# Altium schematic sheet Sheet1 (Luggi-PCs in Konflikt stehende Kopie 2014-04-20).SchDoc
size A4
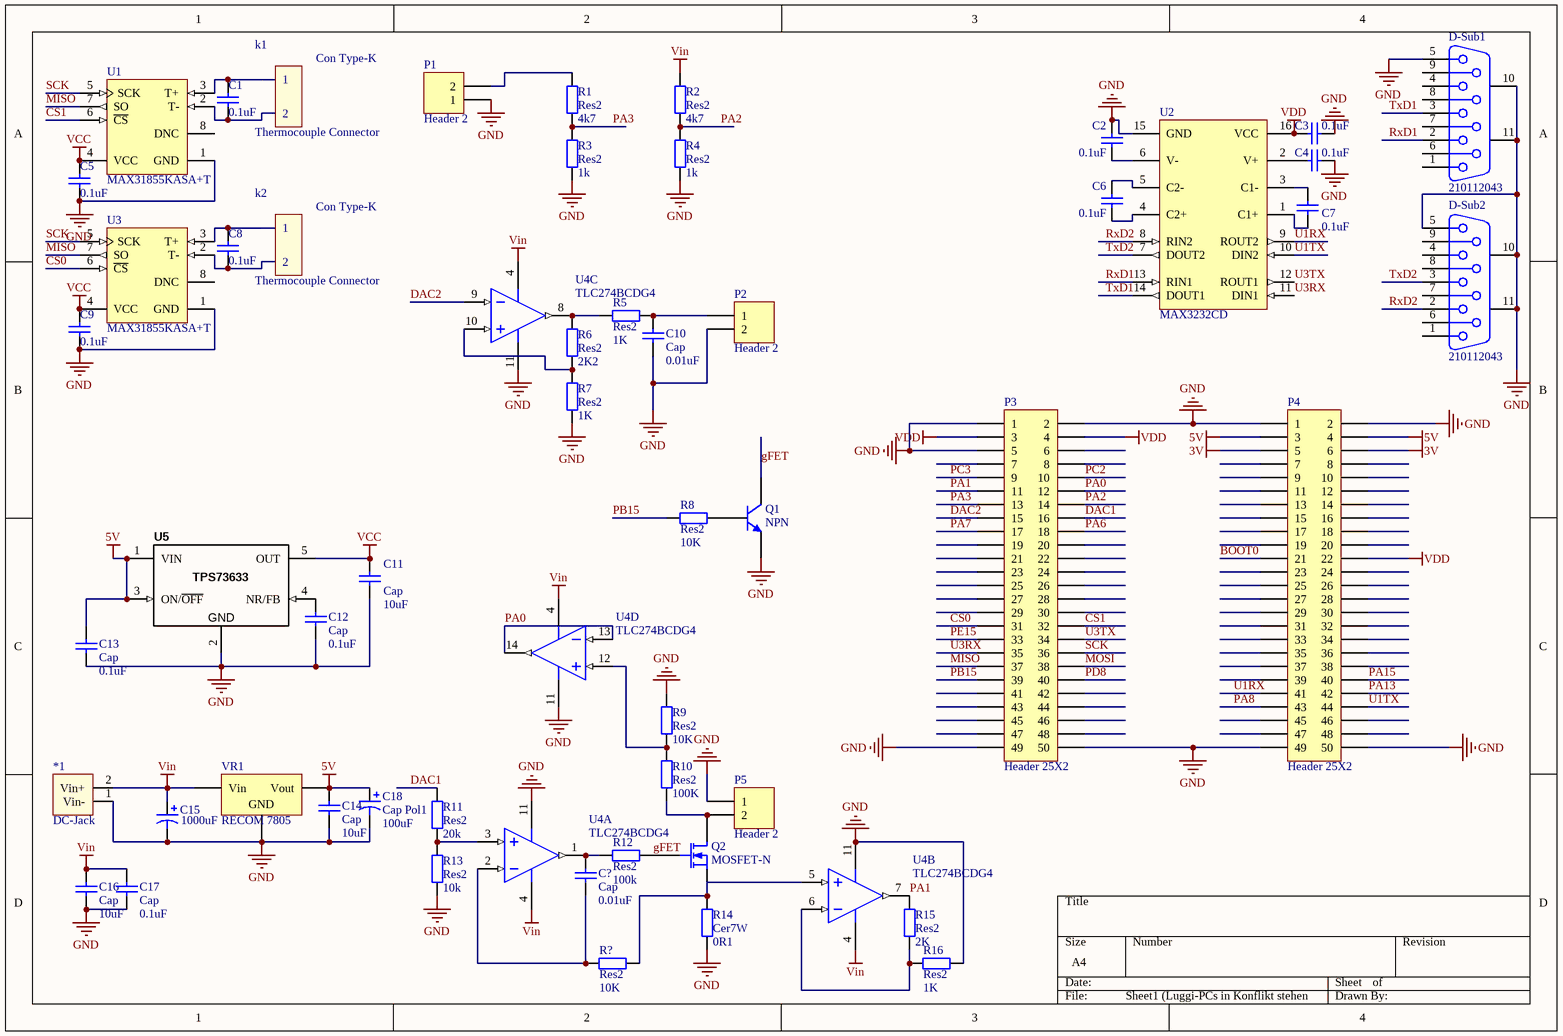
[diagram p0: Sheet1 (Luggi-PCs in Konflikt stehende Kopie 2014-04-20).SchDoc]

## Parts
*1  DC-Jack  [DC-Jack]
C1  value 0.1uF  [CAPC2012X135N]  (hidden comment: Cap)
C2  value 0.1uF  [CAPC2012X135N]  (hidden comment: Cap)
C3  value 0.1uF  [CAPC2012X135N]  (hidden comment: Cap)
C4  value 0.1uF  [CAPC2012X135N]  (hidden comment: Cap)
C5  value 0.1uF  [CAPC2012X135N]  (hidden comment: Cap)
C6  value 0.1uF  [CAPC2012X135N]  (hidden comment: Cap)
C7  value 0.1uF  [CAPC2012X135N]  (hidden comment: Cap)
C8  value 0.1uF  [CAPC2012X135N]  (hidden comment: Cap)
C9  value 0.1uF  [CAPC2012X135N]  (hidden comment: Cap)
C10  Cap  value 0.01uF  [CAPC2012X135N]
C11  Cap  value 10uF  [CAPC2012X135N]
C12  Cap  value 0.1uF  [CAPC2012X135N]
C13  Cap  value 0.1uF  [CAPC2012X135N]
C14  Cap  value 10uF  [CAPC2012X135N]
C15  value 1000uF  [RB7.6-15]  (hidden comment: Cap Pol1)
C16  Cap  value 10uF  [CAPC2012X135N]
C17  Cap  value 0.1uF  [CAPC2012X135N]
C18  Cap Pol1  value 100uF  [RB7.6-15]
C?  Cap  value 0.01uF  [RAD-0.3]
D-Sub1  210112043  [WE-DS, 210112043]
D-Sub2  210112043  [WE-DS, 210112043]
k1  Thermocouple Connector  [K-Type Thermocouple Connector]
k2  Thermocouple Connector  [K-Type Thermocouple Connector]
P1  Header 2  [HDR1X2]
P2  Header 2  [HDR1X2]
P3  Header 25X2  [HDR2X25]
P4  Header 25X2  [HDR2X25]
P5  Header 2  [Connector6A]
Q1  NPN  [SOT-23_N]
Q2  MOSFET-N  [TO-220-AB]
R1  Res2  value 4k7  [RESC2012X70N]
R2  Res2  value 4k7  [RESC2012X70N]
R3  Res2  value 1k  [RESC2012X70N]
R4  Res2  value 1k  [RESC2012X70N]
R5  Res2  value 1K  [RESC2012X70N]
R6  Res2  value 2K2  [RESC2012X70N]
R7  Res2  value 1K  [RESC2012X70N]
R8  Res2  value 10K  [RESC2012X70N]
R9  Res2  value 10K  [RESC2012X70N]
R10  Res2  value 100K  [RESC2012X70N]
R11  Res2  value 20k  [RESC2012X70N]
R12  Res2  value 100k  [RESC2012X70N]
R13  Res2  value 10k  [RESC2012X70N]
R14  Cer7W  value 0R1  [Cer7W]
R15  Res2  value 2K  [RESC2012X70N]
R16  Res2  value 1K  [RESC2012X70N]
R?  Res2  value 10K  [AXIAL-0.4]
U1  MAX31855KASA+T  [MAXM-S8+4_N]
U2  MAX3232CD  [TI-D16_N]
U3  MAX31855KASA+T  [MAXM-S8+4_N]
U4  TLC274BCDG4  [TI-D14_N]  (parts A,B,C,D of 4)
U5  3.3V  [SOT23-5]  (value not drawn)
VR1  RECOM 7805  [Recom78xx]

## Nets
3V: P4.5 P4.6
5V: C13.2 C14.2 C18.1 P4.3 P4.4 U5.1(VIN) U5.3(ON/~{OFF}) VR1.3(Vout)
GND: *1.1(Vin-) C2.2 C3.1 C4.1 C5.1 C9.1 C10.1 C11.1 C12.1 C13.1 C14.1 C15.2 C16.1 C17.1 C18.2 D-Sub1.5 D-Sub1.10(MH1) D-Sub1.11(MH2) D-Sub2.5 D-Sub2.10(MH1) D-Sub2.11(MH2) P1.1 P2.2 P3.1 P3.2 P3.5 P3.49 P3.50 P4.1 P4.2 P4.49 P4.50 P5.1 Q1.3(E) R3.1 R4.1 R7.1 R9.2 R13.1 R14.1 R16.1 U1.1(GND) U2.15(GND) U3.1(GND) U4.11(GND) U5.2(GND) VR1.2(GND)
VCC: C5.2 C9.2 C11.2 U1.4(VCC) U3.4(VCC) U5.5(OUT)
VDD: C3.2 P3.3 P3.4 P4.22 U2.16(VCC)
Vin: *1.2(Vin+) C15.1 C16.2 C17.2 R2.2 U4.4(VDD) VR1.1(Vin)
BOOT0: P4.21
CS0: P3.31 U3.6(~{CS})
CS1: P3.32 U1.6(~{CS})
DAC1: P3.16 R11.2
DAC2: P3.15 U4.9(IN3-)
gFET: Q1.1(C) Q2.2(G) R12.2
MISO: P3.37 U1.7(SO) U3.7(SO)
MOSI: P3.38
PA0: P3.12 U4.13(IN4-) U4.14(OUT4)
PA1: P3.11 R15.2 U4.7(OUT2)
PA2: P3.14 R2.1 R4.2
PA3: P3.13 R1.1 R3.2
PA6: P3.18
PA7: P3.17
PA8: P4.43
PA13: P4.42
PA15: P4.40
PB15: P3.39 R8.2
PC2: P3.10
PC3: P3.9
PD8: P3.40
PE15: P3.33
RxD1: D-Sub1.2 U2.13(RIN1)
RxD2: D-Sub2.2 U2.8(RIN2)
SCK: P3.36 U1.5(SCK) U3.5(SCK)
TxD1: D-Sub1.3 U2.14(DOUT1)
TxD2: D-Sub2.3 U2.7(DOUT2)
U1RX: P4.41 U2.9(ROUT2)
U1TX: P4.44 U2.10(DIN2)
U3RX: P3.35 U2.11(DIN1)
U3TX: P3.34 U2.12(ROUT1)
NetC1_1: C1.1 k1.2 U1.2(T-)
NetC1_2: C1.2 k1.1 U1.3(T+)
NetC2_1: C2.1 U2.6(V-)
NetC4_2: C4.2 U2.2(V+)
NetC6_1: C6.1 U2.4(C2+)
NetC6_2: C6.2 U2.5(C2-)
NetC7_1: C7.1 U2.1(C1+)
NetC7_2: C7.2 U2.3(C1-)
NetC8_1: C8.1 k2.2 U3.2(T-)
NetC8_2: C8.2 k2.1 U3.3(T+)
NetC10_2: C10.2 P2.1 R5.2
NetC12_2: C12.2 U5.4(NR/FB)
NetC?_1: C?.1 R?.1 U4.2(IN1-)
NetC?_2: C?.2 R12.1 U4.1(OUT1)
NetP1_2: P1.2 R1.2
NetP5_2: P5.2 Q2.1(D) R10.1
NetQ1_2: Q1.2(B) R8.1
NetQ2_3: Q2.3(S) R14.2 R?.2 U4.5(IN2+)
NetR5_1: R5.1 R6.2 U4.8(OUT3)
NetR6_1: R6.1 R7.2 U4.10(IN3+)
NetR9_1: R9.1 R10.2 U4.12(IN4+)
NetR11_1: R11.1 R13.2 U4.3(IN1+)
NetR15_1: R15.1 R16.2 U4.6(IN2-)

Not connected (* = marked no-connect by the designer): D-Sub1 1 4 6 7 8 9; D-Sub2 1 4 6 7 8 9; P3 6 7 8 19 20 21 22 23 24 25 26 27 28 29 30 41 42 43 44 45 46 47 48; P4 7 8 9 10 11 12 13 14 15 16 17 18 19 20 23 24 25 26 27 28 29 30 31 32 33 34 35 36 37 38 39 45 46 47 48; U1 8(DNC); U3 8(DNC)

## Notes on the sheet
- (in symbol LinREG_3V3_400mA_TPS73633DBV) TPS73633
- (in symbol Thermocouple Connector) Con Type-K

## Library data of the parts
C1-C14 C16 C17 C? = Cap: Capacitor; Published: 8-Jun-2000; LatestRevisionDate: 17-Jul-2002; LatestRevisionNote: Re-released for DXP Platform.; PackageReference: RAD-0.3; Publisher: Altium Limited; PackageDescription: Radial Cap, Thru-Hole; 2 Leads; 0.3 in Pin Spacing
C15 C18 = Cap Pol1: Polarized Capacitor (Radial); Published: 8-Jun-2000; LatestRevisionDate: 17-Jul-2002; LatestRevisionNote: Re-released for DXP Platform.; PackageReference: RB7.6-15; Publisher: Altium Limited; PackageDescription: Polarized Capacitor (Radial); 2 Leads
D-Sub1 D-Sub2 = WE-DS, 210112043: D-SUB-Filter Connectors WE-DS, Bent 90°,TH; Manufacturer: Würth Elektronik eiSos GmbH; partNo: 210112043; ComponentLink1Description: Manufacturer; ComponentLink1URL: http://www.we-online.de; Created by: Christin Zierenner; Created Date: May 2012; ComponentLink2Description: Datasheet; ComponentLink2URL: http://katalog.we-online.de/kataloge/eisos/index.php?language=en&pf=Filter_abgewinkelt
P1 P2 P5 = Header 2: Header, 2-Pin; LatestRevisionDate: 17-Jul-2002; LatestRevisionNote: Re-released for DXP Platform.; Publisher: Altium Limited
P3 P4 = Header 25X2: Header, 25-Pin, Dual row; LatestRevisionDate: 17-Jul-2002; LatestRevisionNote: Re-released for DXP Platform.; Publisher: Altium Limited
Q1 = NPN: NPN Bipolar Transistor; pin to pad: 1>3 2>1 3>2; Published: 8-Jun-2000; LatestRevisionDate: 17-Jul-2002; LatestRevisionNote: Re-released for DXP Platform.; PackageReference: TO-226-AA; Publisher: Altium Limited; PackageDescription: TO, Flat Index; 3 In-Line, Axial Leads; Body Dia. 4.8mm; Leads 0.55 x 0.51 mm (max); Code_JEDEC: TO-226-AA
Q2 = MOSFET-N: N-Channel MOSFET; pin to pad: 1>2 2>1; Published: 8-Jun-2000; LatestRevisionDate: 17-Jul-2002; LatestRevisionNote: Re-released for DXP Platform.; PackageVersion: 1995/1996; PackageReference: E3; Publisher: Altium Limited; PackageDescription: TO, Flat Index; 3 In-Line, Axial Leads; Body Dia. 4.6mm; Lead Dia. 0.5 mm (max)
R1-R16 R? = Res2: Resistor; Published: 8-Jun-2000; LatestRevisionDate: 17-Jul-2002; LatestRevisionNote: Re-released for DXP Platform.; PackageReference: AXIAL-0.4; Publisher: Altium Limited; PackageDescription: Axial Device, Thru-Hole; 2 Leads; 0.4 in Pin Spacing
U1 U3 = MAX31855KASA+T: Cold Junction Compensated Thermocouple to Digital Converter, 14 Bits Temperature Resolution, -40 to 125 degC, 8-Pin SOIC (S8+4), Pb-Free, Tape ang Reel; Functions: Thermocouple-to-Digital Converter; Interface: SPI; Parasite Pwr.: No; DatasheetVersion: Rev. 2; PackageVersion: Rev. D, 10/2012; PackageReference: S8+4; PackageDescription: 8-Pin Small-Outline IC, Narrow, Body 3.9 x 4.9 mm, Pitch 1.27 mm; Supplier 1: Digi-Key; Supplier Part Number 1: MAX31855KASA+TTR-ND; Supplier 2: Digi-Key; Supplier Part Number 2: MAX31855KASA+TCT-ND; Supplier 3: Digi-Key; Supplier Part Number 3: MAX31855KASA+TDKR-ND; Supplier 4: Mouser; Supplier Part Number 4: 700-MAX31855KASA+T; Packing: Tape ang Reel; Generic Part Number: MAX31855; Mounting Technology: Surface Mount; Code_JEDEC: MS-012; PartNumber: MAX31855KASA+T; ComponentLink1Description: Manufacturer URL; ComponentLink1URL: http://www.maximintegrated.com/; ComponentLink2Description: Datasheet; ComponentLink2URL: http://datasheets.maximintegrated.com/en/ds/MAX31855.pdf; ComponentLink3Description: Package Specification; ComponentLink3URL: http://pdfserv.maximintegrated.com/package_dwgs/21-0041.PDF
U2 = MAX3232CD: 3-V to 5.5-V Multichannel RS-232 Line Driver / Receiver with ±15-kV ESD Protection, 0 to 70 degC, 16-Pin SOIC (D), Green (RoHS & no Sb/Br); Drivers Per Package: 2; Supply Voltage(s)(V): 3.3 or 5.0; ESD HBM(kV): +/-15; ICC(Max)(mA): 1; Single Supply: TRUE; DatasheetVersion: SLLS410I; PackageVersion: revM, Jun-2011; PackageReference: D16; PackageDescription: 16-Pin Plastic Small Outline Integrated Circuit, 9.9 x 3.9 mm, Pitch 1.27 mm Pitch; SubFamily: RS-232; Receivers Per Package: 2; RS-232: TRUE; ComponentLink1Description: Manufacturer URL; ComponentLink1URL: www.ti.com; ComponentLink2Description: Datasheet; ComponentLink2URL: http://www.ti.com/general/docs/lit/getliterature.tsp?genericPartNumber=MAX3232&fileType=pdf; ComponentLink3Description: Package Specification; ComponentLink3URL: http://www.ti.com/litv/pdf/mpds178g
U4 = TLC274BCDG4: LinCMOS(TM) Precision Quad Operational Amplifier, 3 to 16 V, 0 to 70 degC, 14-pin SOIC (D14), Green (RoHS & no Sb/Br); Manufacturer: Texas Instruments; CMRR(Min)(dB): 65; GBW(Typ)(MHz): 1.7; IIB(Max)(pA): 60; Iq per channel(Max)(mA): 1.6; Number of Channels: 4; Offset Drift(Typ)(uV/C): 1.8; Rating: Catalog; Slew Rate(Typ)(V/us): 3.6; Sub Family: General Purpose Amplifier; Total Supply Voltage(Max)(+5V is 5, +/-5V is 10): 16; Total Supply Voltage(Min)(+5V is 5, +/-5V is 10): 3; Vio (25C)(Max)(mV): 2; Vn at 1kHz(Typ)(nV/rtHz): 25; DatasheetVersion: SLOS092D; PackageVersion: 4040047-5/M, 06/2011; PackageReference: D14; PackageDescription: 14-Pin Plastic Small Outline, Body 8.65 x 3.90 mm, Pitch 1.27 mm; Supplier 1: Digi-Key; Supplier Part Number 1: TLC274BCDG4-ND; Supplier 2: Farnell; Supplier Part Number 2: 1234898; Supplier 3: Newark; Supplier Part Number 3: 13M5529; Supplier 4: Newark; Supplier Part Number 4: 54K0952; Supplier 5: Mouser; Supplier Part Number 5: 595-TLC274BCDG4; Eco-Plan: Green (RoHS & no Sb/Br); Mounting Technology: Surface Mount; Code_JEDEC: MS-012; PartNumber: TLC274BCDG4; ComponentLink1Description: Manufacturer URL; ComponentLink1URL: http://www.ti.com/; ComponentLink2Description: Datasheet; ComponentLink2URL: http://www.ti.com/lit/ds/symlink/tlc274b.pdf; ComponentLink3Description: Package Specification; ComponentLink3URL: http://www.ti.com/lit/ml/mpds177g/mpds177g.pdf
U5 = LinREG_3V3_400mA_TPS73633DBV: IC LDO Regulator 3.3V 400mA SOT23-5 SMD; Manufacturer 1: Texas Instruments; Manufacturer Part Number 1: TPS73633DBVT; Voltage Regulator Type: Switching Buck; Tolerance: ±0.5%; Ratings: 5.5Vin Max; Value: 3.3V; 400mA; Regulator Topology: Positive Fixed; Voltage - Input: 3.5V to 5.5V; Voltage - Dropout (Typical): 0.075V @ 400mA; Current - Output: 400mA (Max); SCDType: spec; Package / Case: SOT23-5; Supplier 1: Digi-Key; Supplier Part Number 1: 296-15819-1-ND; Voltage - Output: 3.3V; Current - Limit (Min): 400mA; ComponentLink1URL: http://www.ti.com/lit/ds/symlink/tps73601.pdf; ComponentLink1Description: http://www.ti.com/lit/ds/symlink/tps73601.pdf
VR1 = Volt Reg: Voltage Regulator; pin to pad: 1>3 3>1; Published: 24-Mar-1999; LatestRevisionDate: 29-May-2009; LatestRevisionNote: IPC-7351 Footprint Added.; PackageReference: D2PAK; Publisher: Altium Limited; PackageDescription: 3-Pin Transistor Outline Package 2.54 mm Pitch, 15.1 mm Lead Span